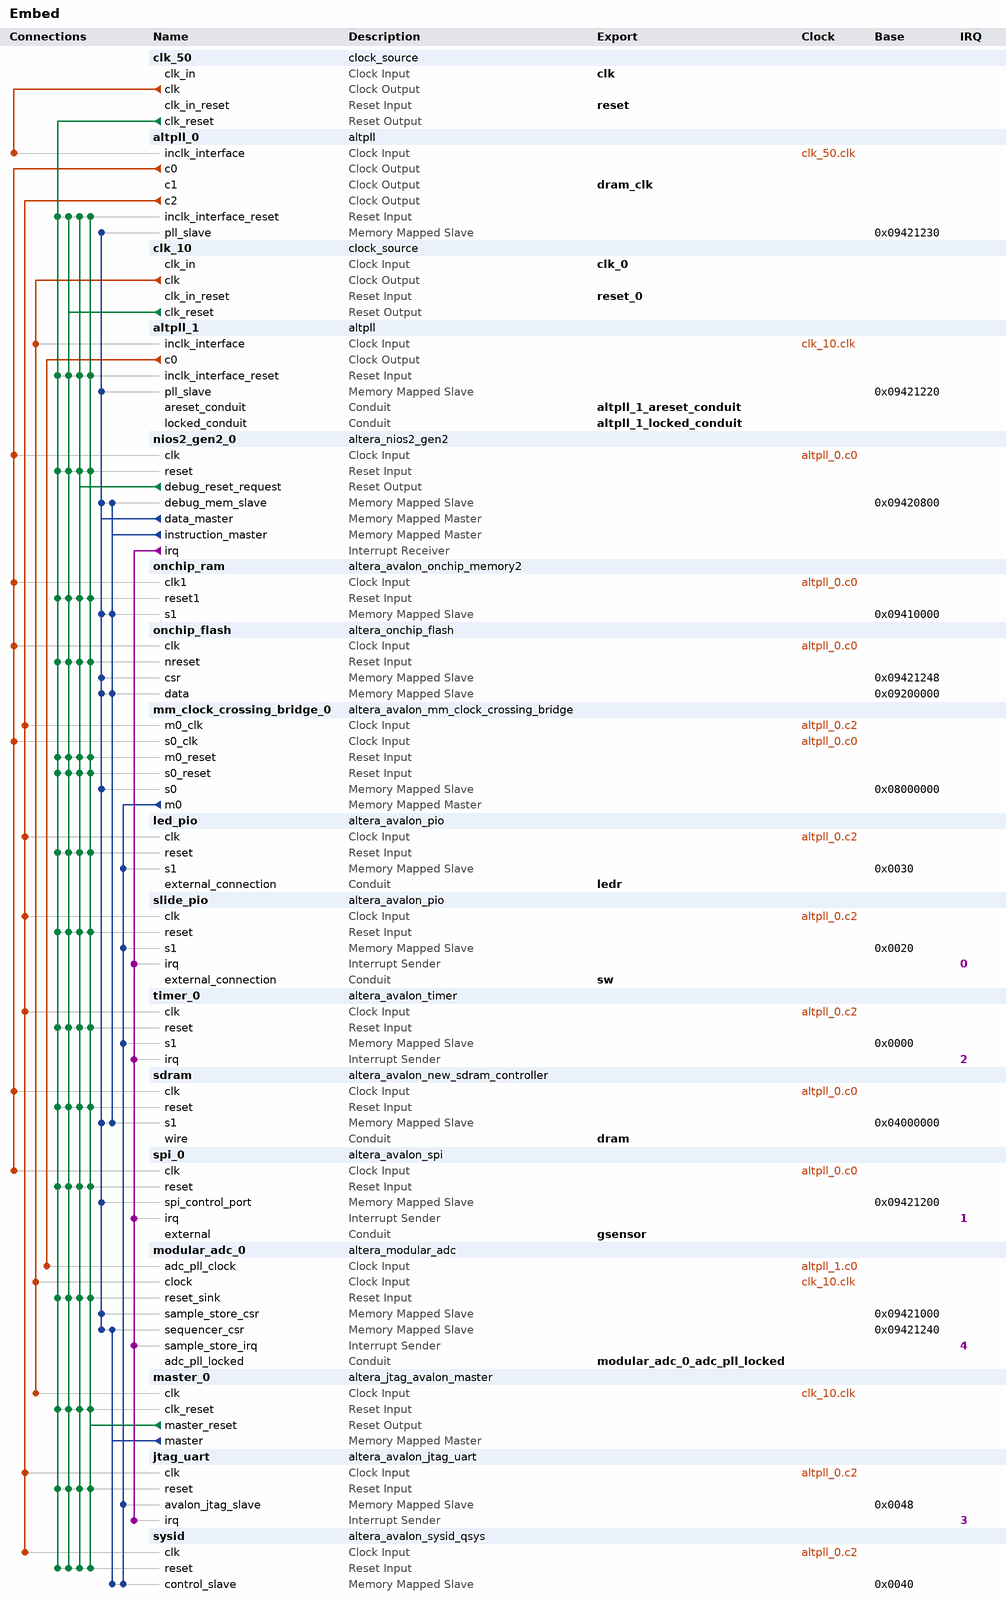
[diagram p0: system contents]
# Platform Designer (Qsys) system Embed, MAX 10 10M50DAF484C6GES
# Parameters at their usual value, and those the tool derives, are not listed.
package require -exact qsys 16.1
create_system Embed
set_project_property DEVICE_FAMILY {MAX 10}
set_project_property DEVICE 10M50DAF484C6GES

add_instance clk_50 clock_source 16.1
set_instance_parameter_value clk_50 clockFrequency 50000000

add_instance altpll_0 altpll 16.1
set_instance_parameter_value altpll_0 CLK0_DIVIDE_BY 1
set_instance_parameter_value altpll_0 CLK0_MULTIPLY_BY 2
set_instance_parameter_value altpll_0 CLK1_DIVIDE_BY 1
set_instance_parameter_value altpll_0 CLK1_DUTY_CYCLE 50
set_instance_parameter_value altpll_0 CLK1_MULTIPLY_BY 2
set_instance_parameter_value altpll_0 CLK1_PHASE_SHIFT -2500
set_instance_parameter_value altpll_0 CLK2_DIVIDE_BY 5
set_instance_parameter_value altpll_0 CLK2_DUTY_CYCLE 50
set_instance_parameter_value altpll_0 CLK2_MULTIPLY_BY 4
set_instance_parameter_value altpll_0 CLK2_PHASE_SHIFT 0
set_instance_parameter_value altpll_0 INCLK0_INPUT_FREQUENCY 20000
set_instance_parameter_value altpll_0 PORT_ARESET PORT_UNUSED
set_instance_parameter_value altpll_0 PORT_LOCKED PORT_UNUSED
set_instance_parameter_value altpll_0 PORT_clk1 PORT_USED
set_instance_parameter_value altpll_0 PORT_clk2 PORT_USED
set_instance_parameter_value altpll_0 PORT_clk3 PORT_UNUSED

add_instance clk_10 clock_source 16.1
set_instance_parameter_value clk_10 clockFrequency 10000000

add_instance altpll_1 altpll 16.1
set_instance_parameter_value altpll_1 CLK0_DIVIDE_BY 1
set_instance_parameter_value altpll_1 CLK0_MULTIPLY_BY 1
set_instance_parameter_value altpll_1 INCLK0_INPUT_FREQUENCY 100000
set_instance_parameter_value altpll_1 PORT_ARESET PORT_USED
set_instance_parameter_value altpll_1 PORT_LOCKED PORT_USED
set_instance_parameter_value altpll_1 PORT_clk1 PORT_UNUSED
set_instance_parameter_value altpll_1 PORT_clk2 PORT_UNUSED
set_instance_parameter_value altpll_1 PORT_clk3 PORT_UNUSED

add_instance nios2_gen2_0 altera_nios2_gen2 16.1
set_instance_parameter_value nios2_gen2_0 dcache_size 2048
set_instance_parameter_value nios2_gen2_0 debug_hwbreakpoint 2
set_instance_parameter_value nios2_gen2_0 exceptionSlave onchip_ram.s1
set_instance_parameter_value nios2_gen2_0 icache_size 4096
set_instance_parameter_value nios2_gen2_0 impl Fast
set_instance_parameter_value nios2_gen2_0 resetSlave onchip_ram.s1

add_instance onchip_ram altera_avalon_onchip_memory2 16.1
set_instance_parameter_value onchip_ram dataWidth 32
set_instance_parameter_value onchip_ram dualPort false
set_instance_parameter_value onchip_ram initMemContent false
set_instance_parameter_value onchip_ram initializationFileName onchip_mem.hex
set_instance_parameter_value onchip_ram memorySize 65536
set_instance_parameter_value onchip_ram resetrequest_enabled false

add_instance onchip_flash altera_onchip_flash 16.1
set_instance_parameter_value onchip_flash CLOCK_FREQUENCY 100.0
set_instance_parameter_value onchip_flash CONFIGURATION_MODE {Single Uncompressed Image with Memory Initialization}
set_instance_parameter_value onchip_flash READ_BURST_COUNT 16
set_instance_parameter_value onchip_flash SECTOR_ACCESS_MODE {Read and write,Read and write,Read and write,Read and write,Read and write}
set_instance_parameter_value onchip_flash initFlashContent false
set_instance_parameter_value onchip_flash initializationFileName altera_onchip_flash.hex
set_instance_parameter_value onchip_flash useNonDefaultInitFile false

add_instance mm_clock_crossing_bridge_0 altera_avalon_mm_clock_crossing_bridge 16.1
set_instance_parameter_value mm_clock_crossing_bridge_0 ADDRESS_UNITS WORDS
set_instance_parameter_value mm_clock_crossing_bridge_0 ADDRESS_WIDTH 10
set_instance_parameter_value mm_clock_crossing_bridge_0 COMMAND_FIFO_DEPTH 8
set_instance_parameter_value mm_clock_crossing_bridge_0 DATA_WIDTH 32
set_instance_parameter_value mm_clock_crossing_bridge_0 MASTER_SYNC_DEPTH 2
set_instance_parameter_value mm_clock_crossing_bridge_0 MAX_BURST_SIZE 1
set_instance_parameter_value mm_clock_crossing_bridge_0 RESPONSE_FIFO_DEPTH 32
set_instance_parameter_value mm_clock_crossing_bridge_0 SLAVE_SYNC_DEPTH 2
set_instance_parameter_value mm_clock_crossing_bridge_0 USE_AUTO_ADDRESS_WIDTH 0

add_instance led_pio altera_avalon_pio 16.1
set_instance_parameter_value led_pio direction Output
set_instance_parameter_value led_pio width 10

add_instance slide_pio altera_avalon_pio 16.1
set_instance_parameter_value slide_pio captureEdge true
set_instance_parameter_value slide_pio direction Input
set_instance_parameter_value slide_pio edgeType ANY
set_instance_parameter_value slide_pio generateIRQ true
set_instance_parameter_value slide_pio irqType EDGE
set_instance_parameter_value slide_pio simDoTestBenchWiring true
set_instance_parameter_value slide_pio simDrivenValue 1023
set_instance_parameter_value slide_pio width 10

add_instance timer_0 altera_avalon_timer 16.1
set_instance_parameter_value timer_0 period 1
set_instance_parameter_value timer_0 periodUnits MSEC

add_instance sdram altera_avalon_new_sdram_controller 16.1
set_instance_parameter_value sdram TAC 5.4
set_instance_parameter_value sdram TRCD 15.0
set_instance_parameter_value sdram TRP 15.0
set_instance_parameter_value sdram casLatency 3
set_instance_parameter_value sdram columnWidth 10
set_instance_parameter_value sdram dataWidth 16
set_instance_parameter_value sdram generateSimulationModel true
set_instance_parameter_value sdram model single_Micron_MT48LC4M32B2_7_chip
set_instance_parameter_value sdram numberOfBanks 4
set_instance_parameter_value sdram numberOfChipSelects 1
set_instance_parameter_value sdram powerUpDelay 100.0
set_instance_parameter_value sdram refreshPeriod 7.8125
set_instance_parameter_value sdram rowWidth 13

add_instance spi_0 altera_avalon_spi 16.1
set_instance_parameter_value spi_0 clockPhase 1
set_instance_parameter_value spi_0 clockPolarity 1
set_instance_parameter_value spi_0 dataWidth 8
set_instance_parameter_value spi_0 masterSPI true
set_instance_parameter_value spi_0 numberOfSlaves 1
set_instance_parameter_value spi_0 targetClockRate 128000

add_instance modular_adc_0 altera_modular_adc 16.1
set_instance_parameter_value modular_adc_0 CLOCK_FREQ 10000000
set_instance_parameter_value modular_adc_0 CORE_VAR 0
set_instance_parameter_value modular_adc_0 DEVICE_PART 10M50DAF484C6GES
set_instance_parameter_value modular_adc_0 ENABLE_DEBUG 1
set_instance_parameter_value modular_adc_0 clkdiv 2
set_instance_parameter_value modular_adc_0 int_vref_vr 3.0
set_instance_parameter_value modular_adc_0 refsel 0
set_instance_parameter_value modular_adc_0 sample_rate 0
set_instance_parameter_value modular_adc_0 seq_order_length 1
set_instance_parameter_value modular_adc_0 seq_order_slot_1 1
set_instance_parameter_value modular_adc_0 seq_order_slot_2 30
set_instance_parameter_value modular_adc_0 seq_order_slot_3 30
set_instance_parameter_value modular_adc_0 seq_order_slot_4 30
set_instance_parameter_value modular_adc_0 seq_order_slot_5 30
set_instance_parameter_value modular_adc_0 seq_order_slot_6 30
set_instance_parameter_value modular_adc_0 seq_order_slot_7 30
set_instance_parameter_value modular_adc_0 use_ch0 false
set_instance_parameter_value modular_adc_0 use_ch2 false
set_instance_parameter_value modular_adc_0 use_ch3 false
set_instance_parameter_value modular_adc_0 use_ch4 false
set_instance_parameter_value modular_adc_0 use_ch5 false
set_instance_parameter_value modular_adc_0 use_ch6 false
set_instance_parameter_value modular_adc_0 use_ch7 false
set_instance_parameter_value modular_adc_0 use_ch8 false
set_instance_parameter_value modular_adc_0 use_tsd false

add_instance master_0 altera_jtag_avalon_master 16.1

add_instance jtag_uart altera_avalon_jtag_uart 16.1
set_instance_parameter_value jtag_uart simInteractiveOptions NO_INTERACTIVE_WINDOWS

add_instance sysid altera_avalon_sysid_qsys 16.1
set_instance_parameter_value sysid id 1911

# connections
add_connection altpll_0.c0 mm_clock_crossing_bridge_0.s0_clk clock
add_connection altpll_0.c0 nios2_gen2_0.clk clock
add_connection altpll_0.c0 onchip_flash.clk clock
add_connection altpll_0.c0 onchip_ram.clk1 clock
add_connection altpll_0.c0 sdram.clk clock
add_connection altpll_0.c0 spi_0.clk clock
add_connection altpll_0.c2 jtag_uart.clk clock
add_connection altpll_0.c2 led_pio.clk clock
add_connection altpll_0.c2 mm_clock_crossing_bridge_0.m0_clk clock
add_connection altpll_0.c2 slide_pio.clk clock
add_connection altpll_0.c2 sysid.clk clock
add_connection altpll_0.c2 timer_0.clk clock
add_connection altpll_1.c0 modular_adc_0.adc_pll_clock clock
add_connection clk_10.clk altpll_1.inclk_interface clock
add_connection clk_10.clk master_0.clk clock
add_connection clk_10.clk modular_adc_0.clock clock
add_connection clk_50.clk altpll_0.inclk_interface clock
add_connection clk_10.clk_reset altpll_0.inclk_interface_reset reset
add_connection clk_10.clk_reset altpll_1.inclk_interface_reset reset
add_connection clk_10.clk_reset jtag_uart.reset reset
add_connection clk_10.clk_reset led_pio.reset reset
add_connection clk_10.clk_reset master_0.clk_reset reset
add_connection clk_10.clk_reset mm_clock_crossing_bridge_0.m0_reset reset
add_connection clk_10.clk_reset mm_clock_crossing_bridge_0.s0_reset reset
add_connection clk_10.clk_reset modular_adc_0.reset_sink reset
add_connection clk_10.clk_reset nios2_gen2_0.reset reset
add_connection clk_10.clk_reset onchip_flash.nreset reset
add_connection clk_10.clk_reset onchip_ram.reset1 reset
add_connection clk_10.clk_reset sdram.reset reset
add_connection clk_10.clk_reset slide_pio.reset reset
add_connection clk_10.clk_reset spi_0.reset reset
add_connection clk_10.clk_reset sysid.reset reset
add_connection clk_10.clk_reset timer_0.reset reset
add_connection clk_50.clk_reset altpll_0.inclk_interface_reset reset
add_connection clk_50.clk_reset altpll_1.inclk_interface_reset reset
add_connection clk_50.clk_reset jtag_uart.reset reset
add_connection clk_50.clk_reset led_pio.reset reset
add_connection clk_50.clk_reset master_0.clk_reset reset
add_connection clk_50.clk_reset mm_clock_crossing_bridge_0.m0_reset reset
add_connection clk_50.clk_reset mm_clock_crossing_bridge_0.s0_reset reset
add_connection clk_50.clk_reset modular_adc_0.reset_sink reset
add_connection clk_50.clk_reset nios2_gen2_0.reset reset
add_connection clk_50.clk_reset onchip_flash.nreset reset
add_connection clk_50.clk_reset onchip_ram.reset1 reset
add_connection clk_50.clk_reset sdram.reset reset
add_connection clk_50.clk_reset slide_pio.reset reset
add_connection clk_50.clk_reset spi_0.reset reset
add_connection clk_50.clk_reset sysid.reset reset
add_connection clk_50.clk_reset timer_0.reset reset
add_connection master_0.master_reset altpll_0.inclk_interface_reset reset
add_connection master_0.master_reset altpll_1.inclk_interface_reset reset
add_connection master_0.master_reset jtag_uart.reset reset
add_connection master_0.master_reset led_pio.reset reset
add_connection master_0.master_reset master_0.clk_reset reset
add_connection master_0.master_reset mm_clock_crossing_bridge_0.m0_reset reset
add_connection master_0.master_reset mm_clock_crossing_bridge_0.s0_reset reset
add_connection master_0.master_reset modular_adc_0.reset_sink reset
add_connection master_0.master_reset nios2_gen2_0.reset reset
add_connection master_0.master_reset onchip_flash.nreset reset
add_connection master_0.master_reset onchip_ram.reset1 reset
add_connection master_0.master_reset sdram.reset reset
add_connection master_0.master_reset slide_pio.reset reset
add_connection master_0.master_reset spi_0.reset reset
add_connection master_0.master_reset sysid.reset reset
add_connection master_0.master_reset timer_0.reset reset
add_connection nios2_gen2_0.debug_reset_request altpll_0.inclk_interface_reset reset
add_connection nios2_gen2_0.debug_reset_request altpll_1.inclk_interface_reset reset
add_connection nios2_gen2_0.debug_reset_request jtag_uart.reset reset
add_connection nios2_gen2_0.debug_reset_request led_pio.reset reset
add_connection nios2_gen2_0.debug_reset_request master_0.clk_reset reset
add_connection nios2_gen2_0.debug_reset_request mm_clock_crossing_bridge_0.m0_reset reset
add_connection nios2_gen2_0.debug_reset_request mm_clock_crossing_bridge_0.s0_reset reset
add_connection nios2_gen2_0.debug_reset_request modular_adc_0.reset_sink reset
add_connection nios2_gen2_0.debug_reset_request nios2_gen2_0.reset reset
add_connection nios2_gen2_0.debug_reset_request onchip_flash.nreset reset
add_connection nios2_gen2_0.debug_reset_request onchip_ram.reset1 reset
add_connection nios2_gen2_0.debug_reset_request sdram.reset reset
add_connection nios2_gen2_0.debug_reset_request slide_pio.reset reset
add_connection nios2_gen2_0.debug_reset_request spi_0.reset reset
add_connection nios2_gen2_0.debug_reset_request sysid.reset reset
add_connection nios2_gen2_0.debug_reset_request timer_0.reset reset
add_connection master_0.master modular_adc_0.sequencer_csr avalon
set_connection_parameter_value master_0.master/modular_adc_0.sequencer_csr baseAddress 0x09421240
add_connection master_0.master sysid.control_slave avalon
set_connection_parameter_value master_0.master/sysid.control_slave baseAddress 0x0040
add_connection mm_clock_crossing_bridge_0.m0 jtag_uart.avalon_jtag_slave avalon
set_connection_parameter_value mm_clock_crossing_bridge_0.m0/jtag_uart.avalon_jtag_slave baseAddress 0x0048
add_connection mm_clock_crossing_bridge_0.m0 led_pio.s1 avalon
set_connection_parameter_value mm_clock_crossing_bridge_0.m0/led_pio.s1 baseAddress 0x0030
add_connection mm_clock_crossing_bridge_0.m0 slide_pio.s1 avalon
set_connection_parameter_value mm_clock_crossing_bridge_0.m0/slide_pio.s1 baseAddress 0x0020
add_connection mm_clock_crossing_bridge_0.m0 sysid.control_slave avalon
set_connection_parameter_value mm_clock_crossing_bridge_0.m0/sysid.control_slave baseAddress 0x0040
add_connection mm_clock_crossing_bridge_0.m0 timer_0.s1 avalon
set_connection_parameter_value mm_clock_crossing_bridge_0.m0/timer_0.s1 baseAddress 0x0000
add_connection nios2_gen2_0.data_master altpll_0.pll_slave avalon
set_connection_parameter_value nios2_gen2_0.data_master/altpll_0.pll_slave baseAddress 0x09421230
add_connection nios2_gen2_0.data_master altpll_1.pll_slave avalon
set_connection_parameter_value nios2_gen2_0.data_master/altpll_1.pll_slave baseAddress 0x09421220
add_connection nios2_gen2_0.data_master mm_clock_crossing_bridge_0.s0 avalon
set_connection_parameter_value nios2_gen2_0.data_master/mm_clock_crossing_bridge_0.s0 baseAddress 0x08000000
add_connection nios2_gen2_0.data_master modular_adc_0.sample_store_csr avalon
set_connection_parameter_value nios2_gen2_0.data_master/modular_adc_0.sample_store_csr baseAddress 0x09421000
add_connection nios2_gen2_0.data_master modular_adc_0.sequencer_csr avalon
set_connection_parameter_value nios2_gen2_0.data_master/modular_adc_0.sequencer_csr baseAddress 0x09421240
add_connection nios2_gen2_0.data_master nios2_gen2_0.debug_mem_slave avalon
set_connection_parameter_value nios2_gen2_0.data_master/nios2_gen2_0.debug_mem_slave baseAddress 0x09420800
add_connection nios2_gen2_0.data_master onchip_flash.csr avalon
set_connection_parameter_value nios2_gen2_0.data_master/onchip_flash.csr baseAddress 0x09421248
add_connection nios2_gen2_0.data_master onchip_flash.data avalon
set_connection_parameter_value nios2_gen2_0.data_master/onchip_flash.data baseAddress 0x09200000
add_connection nios2_gen2_0.data_master onchip_ram.s1 avalon
set_connection_parameter_value nios2_gen2_0.data_master/onchip_ram.s1 baseAddress 0x09410000
add_connection nios2_gen2_0.data_master sdram.s1 avalon
set_connection_parameter_value nios2_gen2_0.data_master/sdram.s1 baseAddress 0x04000000
add_connection nios2_gen2_0.data_master spi_0.spi_control_port avalon
set_connection_parameter_value nios2_gen2_0.data_master/spi_0.spi_control_port baseAddress 0x09421200
add_connection nios2_gen2_0.instruction_master nios2_gen2_0.debug_mem_slave avalon
set_connection_parameter_value nios2_gen2_0.instruction_master/nios2_gen2_0.debug_mem_slave baseAddress 0x09420800
add_connection nios2_gen2_0.instruction_master onchip_flash.data avalon
set_connection_parameter_value nios2_gen2_0.instruction_master/onchip_flash.data baseAddress 0x09200000
add_connection nios2_gen2_0.instruction_master onchip_ram.s1 avalon
set_connection_parameter_value nios2_gen2_0.instruction_master/onchip_ram.s1 baseAddress 0x09410000
add_connection nios2_gen2_0.instruction_master sdram.s1 avalon
set_connection_parameter_value nios2_gen2_0.instruction_master/sdram.s1 baseAddress 0x04000000
add_connection nios2_gen2_0.irq jtag_uart.irq interrupt
set_connection_parameter_value nios2_gen2_0.irq/jtag_uart.irq irqNumber 3
add_connection nios2_gen2_0.irq modular_adc_0.sample_store_irq interrupt
set_connection_parameter_value nios2_gen2_0.irq/modular_adc_0.sample_store_irq irqNumber 4
add_connection nios2_gen2_0.irq slide_pio.irq interrupt
set_connection_parameter_value nios2_gen2_0.irq/slide_pio.irq irqNumber 0
add_connection nios2_gen2_0.irq spi_0.irq interrupt
set_connection_parameter_value nios2_gen2_0.irq/spi_0.irq irqNumber 1
add_connection nios2_gen2_0.irq timer_0.irq interrupt
set_connection_parameter_value nios2_gen2_0.irq/timer_0.irq irqNumber 2

# exported interfaces
add_interface altpll_1_areset_conduit conduit end
set_interface_property altpll_1_areset_conduit EXPORT_OF altpll_1.areset_conduit
add_interface altpll_1_locked_conduit conduit end
set_interface_property altpll_1_locked_conduit EXPORT_OF altpll_1.locked_conduit
add_interface clk clock sink
set_interface_property clk EXPORT_OF clk_50.clk_in
add_interface clk_0 clock sink
set_interface_property clk_0 EXPORT_OF clk_10.clk_in
add_interface dram conduit end
set_interface_property dram EXPORT_OF sdram.wire
add_interface dram_clk clock source
set_interface_property dram_clk EXPORT_OF altpll_0.c1
add_interface gsensor conduit end
set_interface_property gsensor EXPORT_OF spi_0.external
add_interface ledr conduit end
set_interface_property ledr EXPORT_OF led_pio.external_connection
add_interface modular_adc_0_adc_pll_locked conduit end
set_interface_property modular_adc_0_adc_pll_locked EXPORT_OF modular_adc_0.adc_pll_locked
add_interface reset reset sink
set_interface_property reset EXPORT_OF clk_50.clk_in_reset
add_interface reset_0 reset sink
set_interface_property reset_0 EXPORT_OF clk_10.clk_in_reset
add_interface sw conduit end
set_interface_property sw EXPORT_OF slide_pio.external_connection

set_interconnect_requirement {$system} qsys_mm.clockCrossingAdapter HANDSHAKE
set_interconnect_requirement {$system} qsys_mm.enableEccProtection FALSE
set_interconnect_requirement {$system} qsys_mm.insertDefaultSlave FALSE
set_interconnect_requirement {$system} qsys_mm.maxAdditionalLatency 1

save_system Embed.qsys
